# Altium project esp_slave.PrjPcb
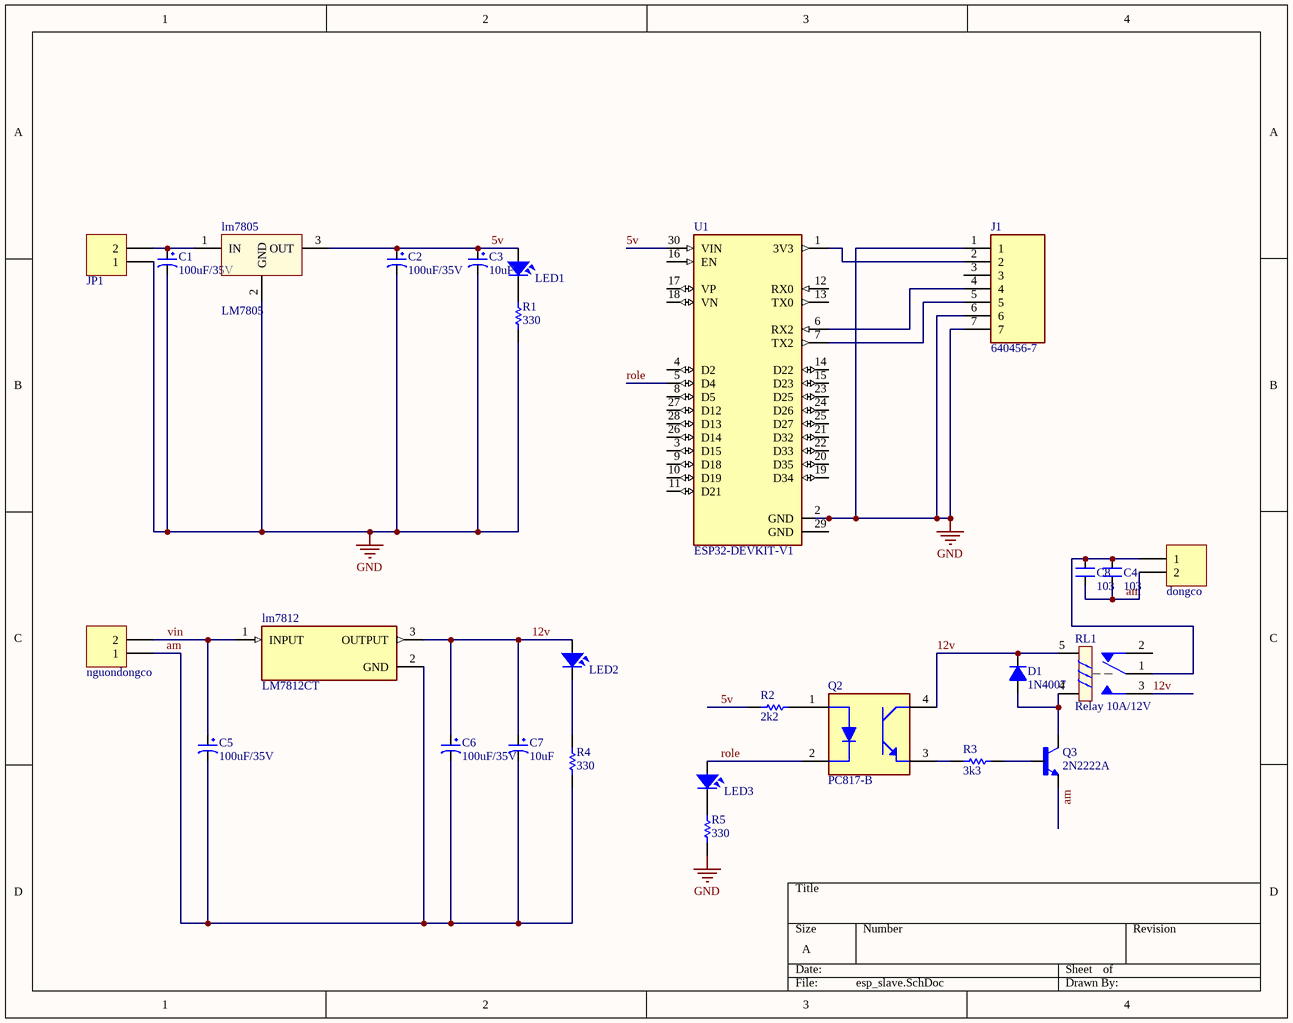
[diagram p0: esp_slave.SchDoc]
1 sheet, 27 parts. Net scope: global (net labels, ports and power ports of the same name join across sheets).
Board file: esp_slave.PcbDoc

## Sheet esp_slave.SchDoc
size A; SheetNumber: 1; SheetTotal: 1

### Parts
C1  100uF/35V  [CP1.5/3.4]
C2  100uF/35V  [CP1.5/3.4]
C3  10uF  [CP1/2]
C4  103  [CN1.5]
C5  100uF/35V  [CP1.5/3.4]
C6  100uF/35V  [CP1.5/3.4]
C7  10uF  [CP1/2]
C8  103  [CN1.5]
D1  1N4007  [D1A]
dongco  Header 2_1  [HED2]  (value not drawn)
J1  640456-7  [TE_640456-7]
JP1  Header 2_1  [HED2]  (value not drawn)
LED1  LED  [LED-3]  (value not drawn)
LED2  LED  [LED-3]  (value not drawn)
LED3  LED  [LED-3]  (value not drawn)
lm7805  LM7805  [QTO-220]
lm7812  LM7812CT  [TO253P1057X470X2040-3]
nguondongco  Header 2_1  [HED2]  (value not drawn)
Q2  PC817-B  [DIP762W50P254L650H455Q4B]
Q3  2N2222A  [TO92254P470H750-3]
R1  value 330  [R1/4W]  (hidden comment: Res1)
R2  value 2k2  [R1/4W]  (hidden comment: Res1)
R3  value 3k3  [R1/4W]  (hidden comment: Res1)
R4  value 330  [R1/4W]  (hidden comment: Res1)
R5  value 330  [R1/4W]  (hidden comment: Res1)
RL1  Relay 10A/12V  [RL_SPDT_10A]
U1  ESP32-DEVKIT-V1  [MODULE_ESP32_DEVKIT_V1]

### Nets
GND: C1.2 C2.2 C3.2 J1.1 J1.6 J1.7 JP1.1 lm7805.2(GND) R1.2 R5.2 U1.2(GND)
5v: C2.1 C3.1 LED1.1 lm7805.3(OUT) R2.1 U1.30(VIN)
12v: C6.1 C7.1 D1.2(K) LED2.1 lm7812.3(OUTPUT) Q2.4(COLLECTOR) RL1.3 RL1.5
am: C4.1 C5.2 C6.2 C7.2 C8.1 dongco.2 lm7812.2(GND) nguondongco.1 Q3.1(E) R4.2
role: LED3.1 Q2.2(CATHODE) U1.5(D4)
vin: C5.1 lm7812.1(INPUT) nguondongco.2
NetC1_1: C1.1 JP1.2 lm7805.1(IN)
NetC4_2: C4.2 C8.2 dongco.1 RL1.1
NetD1_1: D1.1(A) Q3.3(C) RL1.4
NetJ1_2: J1.2 U1.1(3V3)
NetJ1_4: J1.4 U1.6(RX2)
NetJ1_5: J1.5 U1.7(TX2)
NetLED1_2: LED1.2 R1.1
NetLED2_2: LED2.2 R4.1
NetLED3_2: LED3.2 R5.1
NetQ2_1: Q2.1(ANODE) R2.2
NetQ2_3: Q2.3(EMITTER) R3.1
NetQ3_2: Q3.2(B) R3.2

Not connected (* = marked no-connect by the designer): J1 3; RL1 2; U1 3(D15) 4(D2) 8(D5) 9(D18) 10(D19) 11(D21) 12(RX0) 13(TX0) 14(D22) 15(D23) 16(EN) 17(VP) 18(VN) 19(D34) 20(D35) 21(D32) 22(D33) 23(D25) 24(D26) 25(D27) 26(D14) 27(D12) 28(D13) 29(GND)

### Library data of the parts
C1 C2 C5 C6 = CP3: Cap 100uF/35V - 470uF/16V; Value: 100uF/35V/50V; Description 1: 1000uF/6,3V - 470uF/16V - 330uF - 25V; Description 2: 220uF/35V - 100uF/50V - 63V - 4,7uF/200V; Description 3: 22uF => 33uF100V - 3,3uF => 4,7uF/250V; Description 4: 2,2uF =>3,3uF/350 - 2,2uF/400V - 1uF/450V
C3 C7 = CP1: Cap P  0,1uF < 22uF , 16 - 50V; Value: 10uF/50V; Description 1: 10 => 220uF/6,3V/10V - 10uF => 100uF/16V; Description 2: 0,1uF => 33uF/50V - 10uF => 22uF/63V; Description 3: 0,47uF => 10uF/100V
C4 C8 = CN1.5: Cap np 682pF => 104pF; Value: 0.01uF
D1 = D1A: Diode 1A; Value: 1N4007
dongco JP1 nguondongco = Header 2_1: Header, 2-Pin; Manufacturer: Generic Components; Class: Connector; Value: Header 2
J1 = 640456-7: Header Friction Lock MTA-100 7 250 VAC Polyester Tin Copper Alloy Tin | TE Connectivity 640456-7; SnapEDA_Link: https://www.snapeda.com/parts/640456-7/TE+Connectivity+AMP+Connectors/view-part/?ref=snap; Package: None; Value: *; MF: TE Connectivity; MP: 640456-7; Check_prices: https://www.snapeda.com/parts/640456-7/TE+Connectivity+AMP+Connectors/view-part/?ref=eda
LED1-LED3 = LED: LED Single colour Green and Red; Value: LED 3 ly Single Colour
lm7805 = LM78xx: On ap +, from + 5 to + 24VDC; Value: LM7805
lm7812 = LM7812CT: Linear Voltage Regulator IC Positive Fixed 1 Output 1A TO-220-3; MF: ON Semiconductor; SnapEDA_Link: https://www.snapeda.com/parts/LM7812CT/Onsemi/view-part/?ref=snap; Package: TO-220-3 ON; Value: *; MP: LM7812CT; Check_prices: https://www.snapeda.com/parts/LM7812CT/Onsemi/view-part/?ref=eda
Q2 = PC817-B: Phototransistors 4-DIP (0.300, 7.62mm); MF: American Bright; SnapEDA_Link: https://www.snapeda.com/parts/PC817-B/American+Bright/view-part/?ref=snap; Package: DIP-4 American Bright; Value: *; MP: PC817-B; Check_prices: https://www.snapeda.com/parts/PC817-B/American+Bright/view-part/?ref=eda
Q3 = 2N2222A: BJT, TO-92, 40V, 600mA, NPN, 0.625W, 150Â°C; MF: Diotec Semiconductor; SnapEDA_Link: https://www.snapeda.com/parts/2N2222A/Diotec/view-part/?ref=snap; Package: TO-92 Diotec; Value: *; MP: 2N2222A; Check_prices: https://www.snapeda.com/parts/2N2222A/Diotec/view-part/?ref=eda
R1-R5 = Res1_4: Resistor; Manufacturer: Generic Components; Class: Passive; Published: 08/06/2000; Publisher: Altium Hobart Technology Centre; SubClass: Resistor
RL1 = Relay 1: Relay SPDT,10A - 12VDC 5 Pin; Value: Relay SPDT, 10A, 12V
U1 = ESP32-DEVKIT-V1: Dual core, Wi-Fi: 2.4 GHz up to 150 Mbits/s,BLE (Bluetooth Low Energy) and legacy Bluetooth, 32 bits, Up to 240 MHz; MF: Do it; SnapEDA_Link: https://www.snapeda.com/parts/ESP32-DEVKIT-V1/Do+it/view-part/?ref=snap; Package: None; Value: *; MP: ESP32-DEVKIT-V1; Check_prices: https://www.snapeda.com/parts/ESP32-DEVKIT-V1/Do+it/view-part/?ref=eda